# Altium schematic sheet relais.SchDoc: Relais output board
size A3; Author: Francesco Sacchi <batt@develer.com>; Organization: Develer s.r.l.; Address1: via Mugellese 1/A; Address2: 50019 Campi Bisenzio; Address3: Firenze; Address4: ITALY; DocumentNumber: 1; Revision: 0; SheetNumber: 1; SheetTotal: 6
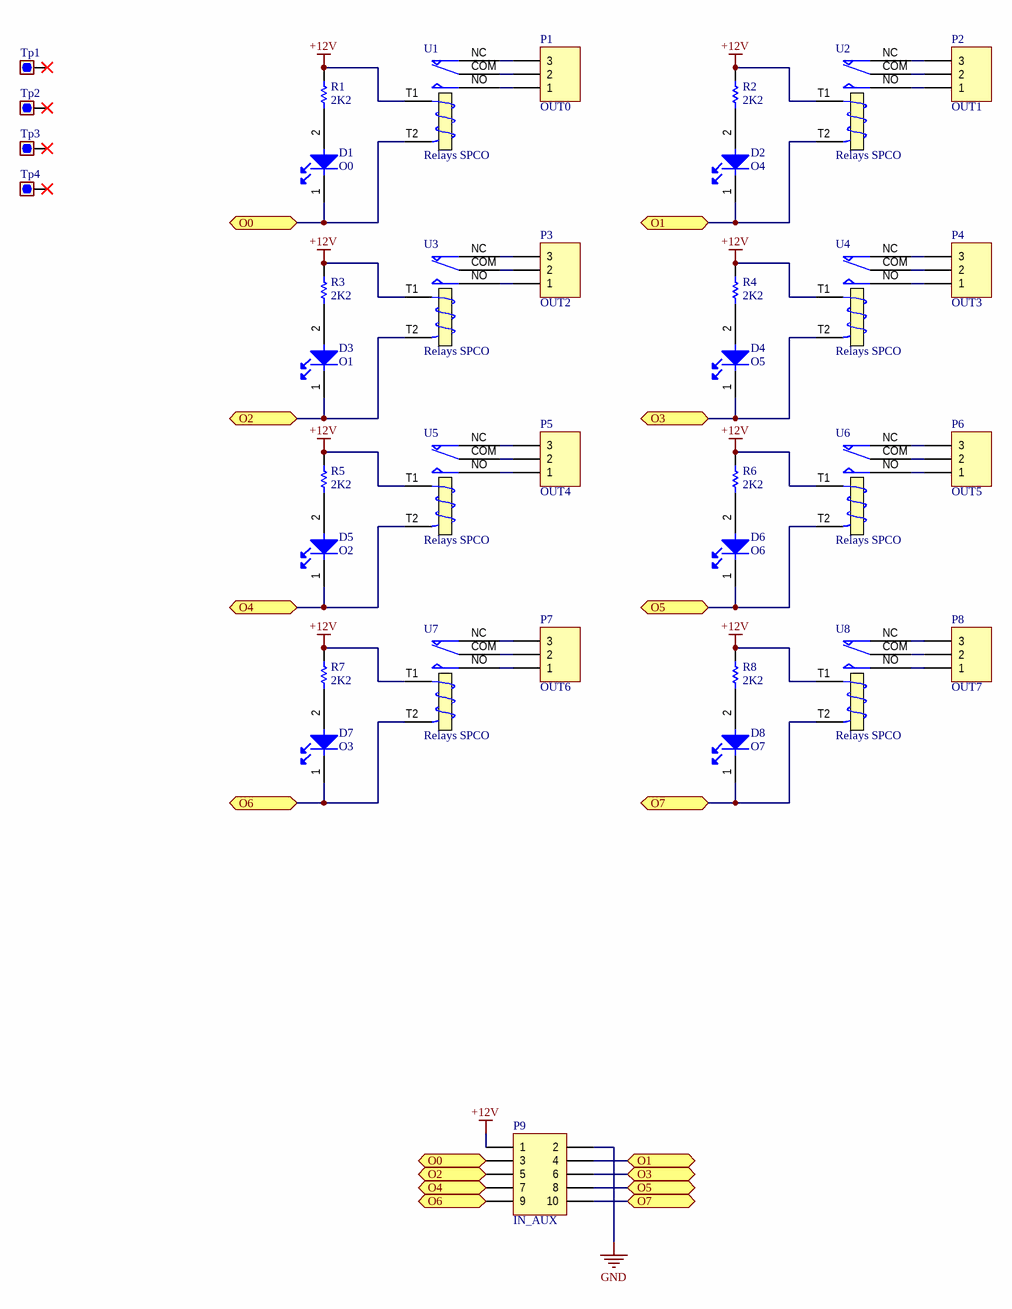
[diagram p0: relais.SchDoc]

## Parts
D1  O0  [0805_[2012]_LED]
D2  O4  [0805_[2012]_LED]
D3  O1  [0805_[2012]_LED]
D4  O5  [0805_[2012]_LED]
D5  O2  [0805_[2012]_LED]
D6  O6  [0805_[2012]_LED]
D7  O3  [0805_[2012]_LED]
D8  O7  [0805_[2012]_LED]
P1  OUT0  [TBLOCK_1X3_5.08MM_THD]
P2  OUT1  [TBLOCK_1X3_5.08MM_THD]
P3  OUT2  [TBLOCK_1X3_5.08MM_THD]
P4  OUT3  [TBLOCK_1X3_5.08MM_THD]
P5  OUT4  [TBLOCK_1X3_5.08MM_THD]
P6  OUT5  [TBLOCK_1X3_5.08MM_THD]
P7  OUT6  [TBLOCK_1X3_5.08MM_THD]
P8  OUT7  [TBLOCK_1X3_5.08MM_THD]
P9  IN_AUX  [HEADER_2X5_2.54MM_THD_BOXED]
R1  2K2  [0603_[1608]]
R2  2K2  [0603_[1608]]
R3  2K2  [0603_[1608]]
R4  2K2  [0603_[1608]]
R5  2K2  [0603_[1608]]
R6  2K2  [0603_[1608]]
R7  2K2  [0603_[1608]]
R8  2K2  [0603_[1608]]
Tp1  (no value)  [Hole_M3x6mm]  (no BOM)
Tp2  (no value)  [Hole_M3x6mm]  (no BOM)
Tp3  (no value)  [Hole_M3x6mm]  (no BOM)
Tp4  (no value)  [Hole_M3x6mm]  (no BOM)
U1  Relays SPCO  [RELAYS_SPCO_THD_20x10mirror]
U2  Relays SPCO  [RELAYS_SPCO_THD_20x10mirror]
U3  Relays SPCO  [RELAYS_SPCO_THD_20x10mirror]
U4  Relays SPCO  [RELAYS_SPCO_THD_20x10mirror]
U5  Relays SPCO  [RELAYS_SPCO_THD_20x10mirror]
U6  Relays SPCO  [RELAYS_SPCO_THD_20x10mirror]
U7  Relays SPCO  [RELAYS_SPCO_THD_20x10mirror]
U8  Relays SPCO  [RELAYS_SPCO_THD_20x10mirror]

## Ports
O0, O1, O2, O3, O4, O5, O6, O7

## Nets
+12V: P9.1 R1.2 R2.2 R3.2 R4.2 R5.2 R6.2 R7.2 R8.2 U1.T1 U2.T1 U3.T1 U4.T1 U5.T1 U6.T1 U7.T1 U8.T1
GND: P9.2
O0: D1.1(K) P9.3 U1.T2 ; port O0
O1: D2.1(K) P9.4 U2.T2 ; port O1
O2: D3.1(K) P9.5 U3.T2 ; port O2
O3: D4.1(K) P9.6 U4.T2 ; port O3
O4: D5.1(K) P9.7 U5.T2 ; port O4
O5: D6.1(K) P9.8 U6.T2 ; port O5
O6: D7.1(K) P9.9 U7.T2 ; port O6
O7: D8.1(K) P9.10 U8.T2 ; port O7
NetD1_2: D1.2(A) R1.1
NetD2_2: D2.2(A) R2.1
NetD3_2: D3.2(A) R3.1
NetD4_2: D4.2(A) R4.1
NetD5_2: D5.2(A) R5.1
NetD6_2: D6.2(A) R6.1
NetD7_2: D7.2(A) R7.1
NetD8_2: D8.2(A) R8.1
NetP1_1: P1.1 U1.NO
NetP1_2: P1.2 U1.COM
NetP1_3: P1.3 U1.NC
NetP2_1: P2.1 U2.NO
NetP2_2: P2.2 U2.COM
NetP2_3: P2.3 U2.NC
NetP3_1: P3.1 U3.NO
NetP3_2: P3.2 U3.COM
NetP3_3: P3.3 U3.NC
NetP4_1: P4.1 U4.NO
NetP4_2: P4.2 U4.COM
NetP4_3: P4.3 U4.NC
NetP5_1: P5.1 U5.NO
NetP5_2: P5.2 U5.COM
NetP5_3: P5.3 U5.NC
NetP6_1: P6.1 U6.NO
NetP6_2: P6.2 U6.COM
NetP6_3: P6.3 U6.NC
NetP7_1: P7.1 U7.NO
NetP7_2: P7.2 U7.COM
NetP7_3: P7.3 U7.NC
NetP8_1: P8.1 U8.NO
NetP8_2: P8.2 U8.COM
NetP8_3: P8.3 U8.NC

Not connected (* = marked no-connect by the designer): Tp1 1*; Tp2 1*; Tp3 1*; Tp4 1*

## Notes on the sheet
- Title:
- Author:
- License:
- BSD
- Rev:
- Size:
- A3
- File:
- Date:
- Time:
- Sheet
- of

## Library data of the parts
D1-D8 = LED: Multicolor LED
P1-P8 = Header 3: Header, 3-Pin; LatestRevisionDate: 17-Jul-2002; LatestRevisionNote: Re-released for DXP Platform.; Publisher: Altium Limited
P9 = Header 5X2: Header, 5-Pin, Dual row; LatestRevisionDate: 17-Jul-2002; LatestRevisionNote: Re-released for DXP Platform.; Publisher: Altium Limited
R1-R8 = Res1: Resistor; Revision: July-2002: Re-released for DXP Platform.
Tp1-Tp4 = Test_point
U1-U8 = Relay SPCO